# EAGLE schematic untitled6 (EAGLE 7.6.0)
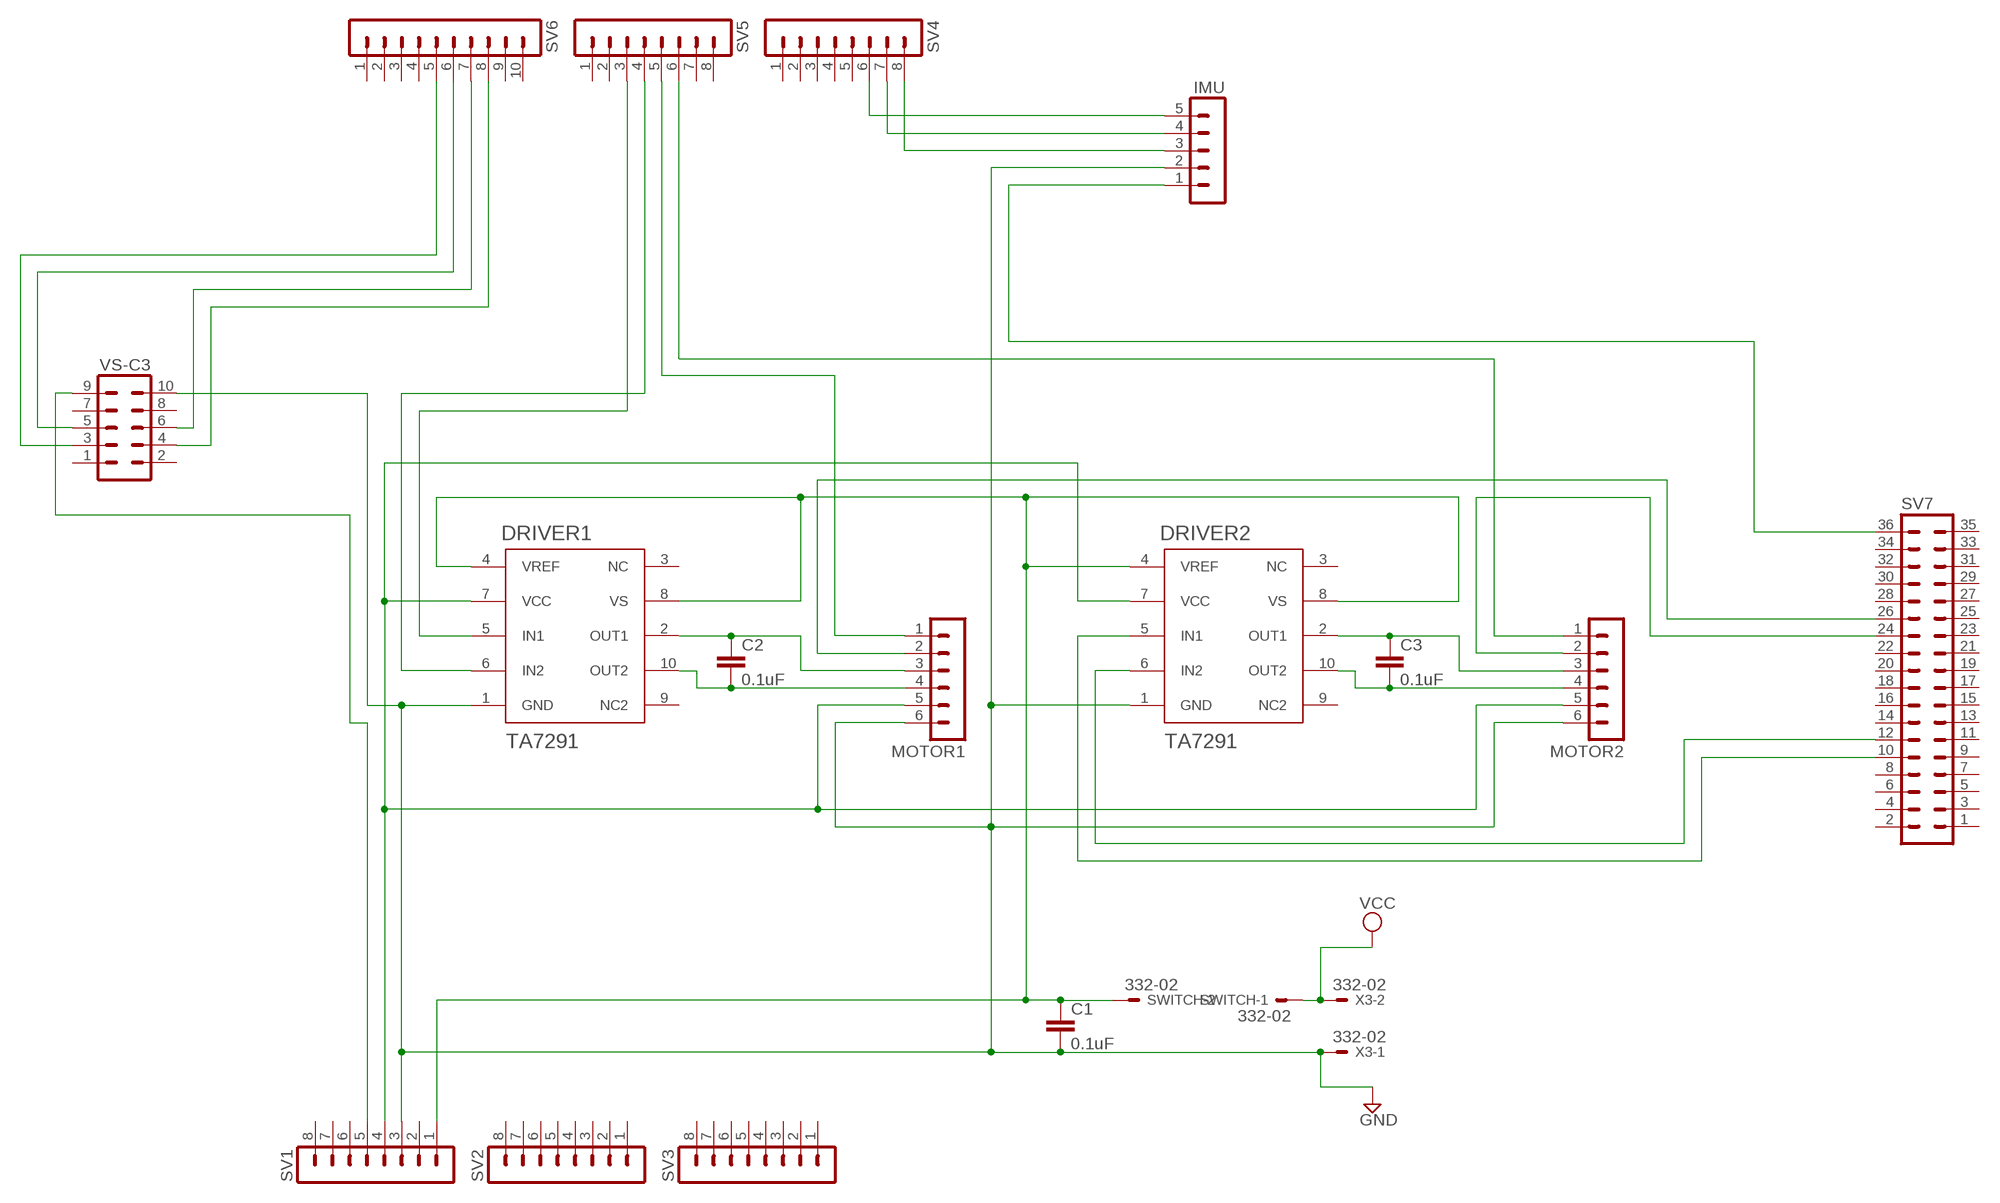
[diagram p0: schematic, sheet 1]

## Parts
C1  0.1uF  C5/2.5  [C5B2.5]
C2  0.1uF  C5/2.5  [C5B2.5]
C3  0.1uF  C5/2.5  [C5B2.5]
DRIVER1  TA7291  [HSIP10]
DRIVER2  TA7291  [HSIP10]
IMU  MA05-1  [MA05-1]
MOTOR1  MA06-1  [MA06-1]
MOTOR2  MA06-1  [MA06-1]
SV1  MA08-1  [MA08-1]
SV2  MA08-1  [MA08-1]
SV3  MA08-1  [MA08-1]
SV4  MA08-1  [MA08-1]
SV5  MA08-1  [MA08-1]
SV6  MA10-1  [MA10-1]
SV7  MA18-2  [MA18-2]
SWITCH  332-02  [332-02]
VS-C3  MA05-2  [MA05-2]
X3  332-02  [332-02]

## Nets
ENCODER: IMU.5 SV4.6
GND: C1.2 DRIVER1.1(GND) DRIVER2.1(GND) IMU.2 MOTOR1.6 MOTOR2.6 SV1.3 VS-C3.10 X3.1
N$1: C2.1 DRIVER1.2(OUT1) MOTOR1.3
N$2: C2.2 DRIVER1.10(OUT2) MOTOR1.4
N$3: C3.1 DRIVER2.2(OUT1) MOTOR2.3
N$4: C3.2 DRIVER2.10(OUT2) MOTOR2.4
N$5: IMU.1 SV7.36
N$6: MOTOR2.1 SV5.6
N$7: DRIVER1.7(VCC) DRIVER2.7(VCC) MOTOR1.5 MOTOR2.5 SV1.4
N$8: IMU.3 SV4.8
N$9: IMU.4 SV4.7
N$10: DRIVER2.5(IN1) SV7.10
N$11: DRIVER2.6(IN2) SV7.12
N$12: DRIVER1.5(IN1) SV5.3
N$13: MOTOR1.1 SV5.5
N$14: MOTOR1.2 SV7.26
N$15: MOTOR2.2 SV7.24
N$16: DRIVER1.6(IN2) SV5.4
N$19: SV1.5 VS-C3.9
N$20: SV6.6 VS-C3.5
N$21: SV6.5 VS-C3.3
N$22: SV6.8 VS-C3.4
N$23: SV6.7 VS-C3.6
N$24: C1.1 DRIVER1.4(VREF) DRIVER1.8(VS) DRIVER2.4(VREF) DRIVER2.8(VS) SV1.1 SWITCH.2
VCC: SWITCH.1 X3.2
Unconnected: DRIVER1.3(NC) DRIVER1.9(NC2) DRIVER2.3(NC) DRIVER2.9(NC2) SV1.2 SV1.6 SV1.7 SV1.8 SV2.1 SV2.2 SV2.3 SV2.4 SV2.5 SV2.6 SV2.7 SV2.8 SV3.1 SV3.2 SV3.3 SV3.4 SV3.5 SV3.6 SV3.7 SV3.8 SV4.1 SV4.2 SV4.3 SV4.4 SV4.5 SV5.1 SV5.2 SV5.7 SV5.8 SV6.1 SV6.2 SV6.3 SV6.4 SV6.9 SV6.10 SV7.1 SV7.2 SV7.3 SV7.4 SV7.5 SV7.6 SV7.7 SV7.8 SV7.9 SV7.11 SV7.13 SV7.14 SV7.15 SV7.16 SV7.17 SV7.18 SV7.19 SV7.20 SV7.21 SV7.22 SV7.23 SV7.25 SV7.27 SV7.28 SV7.29 SV7.30 SV7.31 SV7.32 SV7.33 SV7.34 SV7.35 VS-C3.1 VS-C3.2 VS-C3.7 VS-C3.8

## Library data of the parts
C1-C3 = capacitor-wima:C: CAPACITOR naming: grid - package width
DRIVER1 DRIVER2 = TA7291P:TA7291
IMU = con-lstb:MA05-1: PIN HEADER; OC_FARNELL: unknown; OC_NEWARK: unknown
MOTOR1 MOTOR2 = con-lstb:MA06-1: PIN HEADER; OC_FARNELL: unknown; OC_NEWARK: unknown
SV1-SV5 = con-lstb:MA08-1: PIN HEADER; OC_FARNELL: unknown; OC_NEWARK: unknown
SV6 = con-lstb:MA10-1: PIN HEADER; OC_FARNELL: unknown; OC_NEWARK: unknown
SV7 = con-lstb:MA18-2: PIN HEADER; OC_FARNELL: unknown; OC_NEWARK: unknown
SWITCH X3 = con-garry:332-02: 2 Pin - 2mm Dual Row Source: www.mpe-connector.de / garry_shortform_2012.pdf
VS-C3 = con-lstb:MA05-2: PIN HEADER; OC_FARNELL: unknown; OC_NEWARK: unknown